# Altium project MACHDEN.PrjPcb
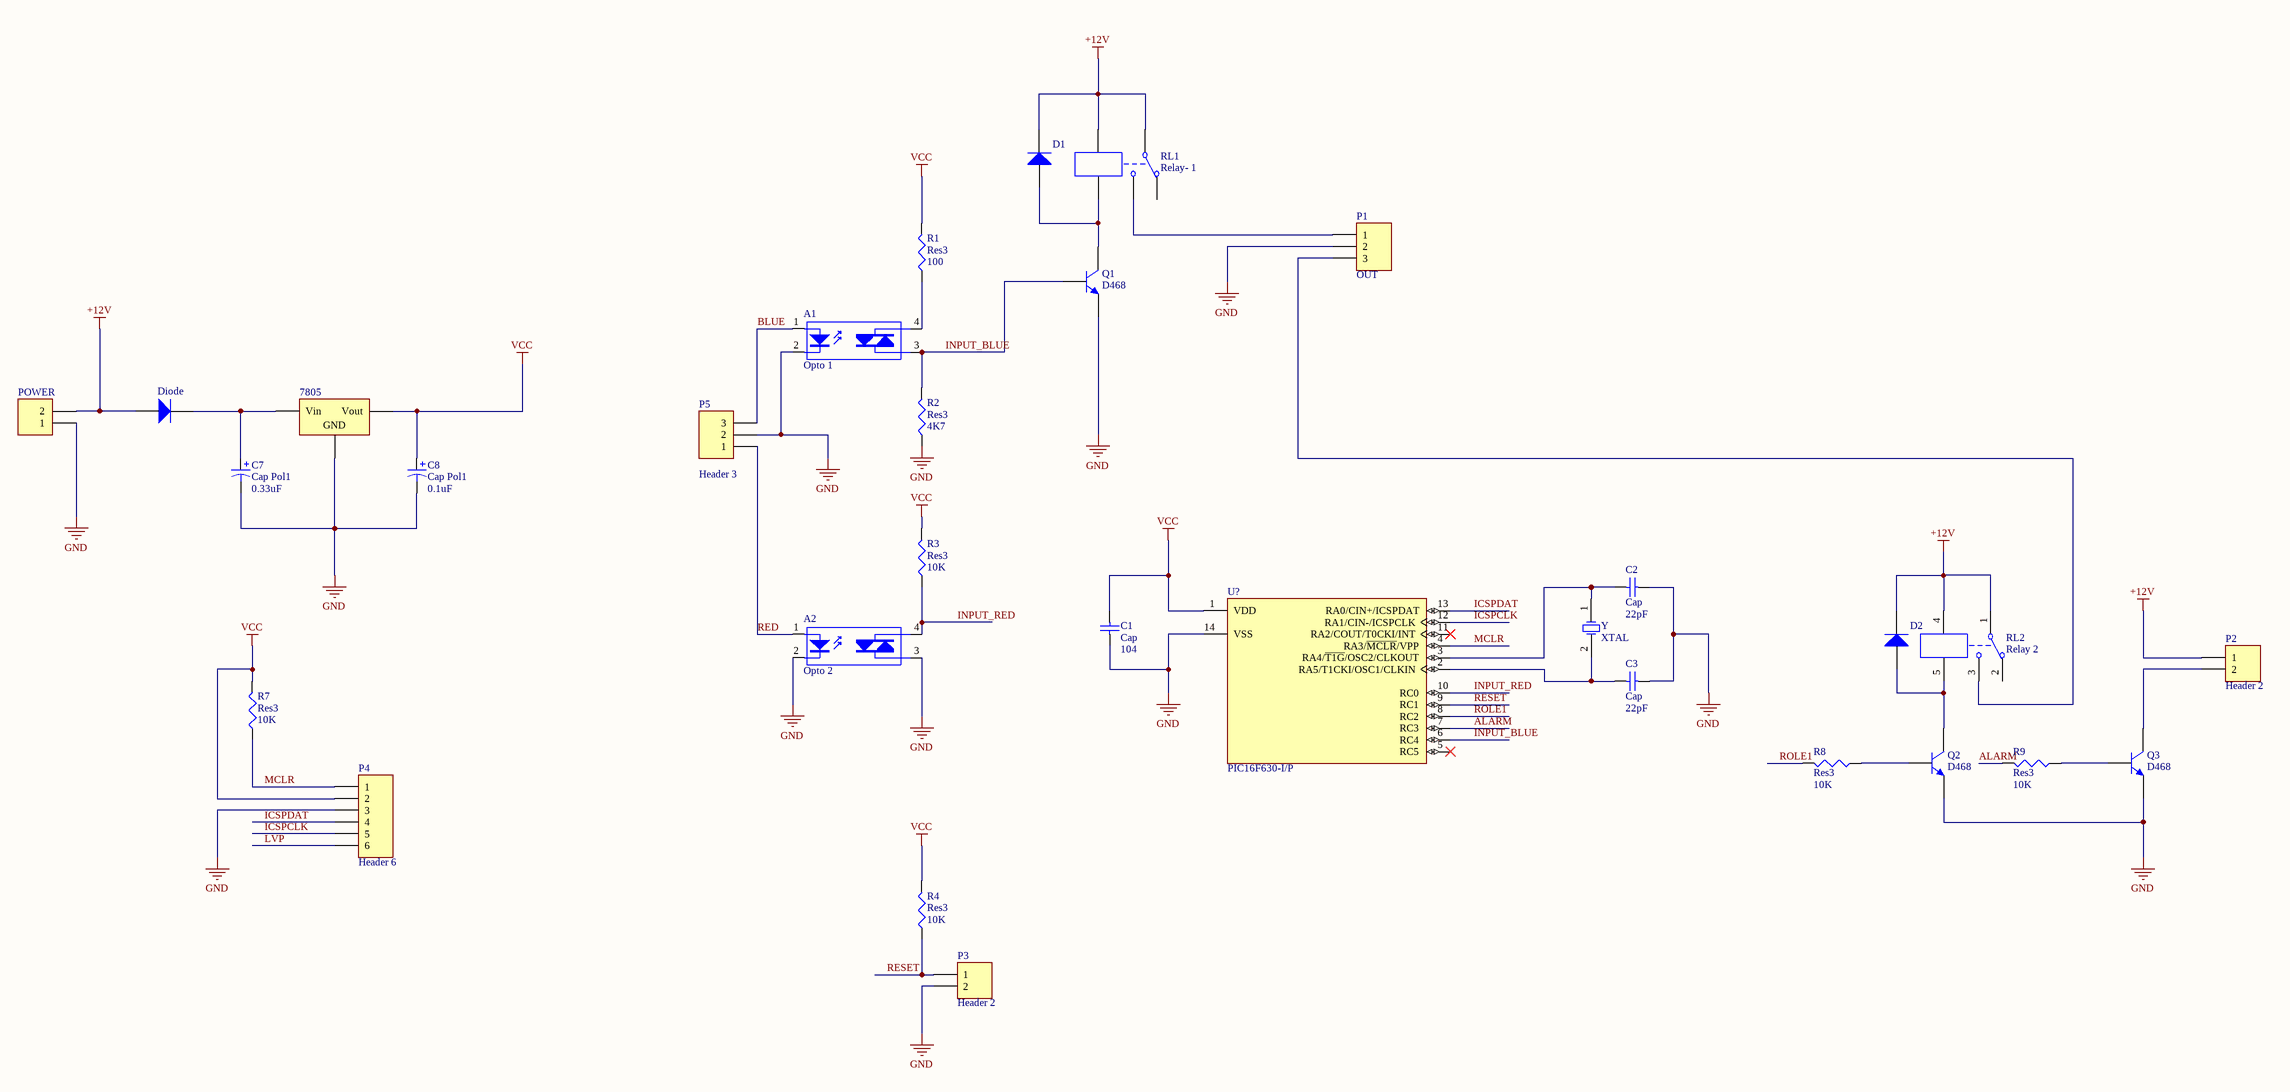
[diagram p0: MACHDEN.SchDoc]
1 sheet, 31 parts. Net scope: global (net labels, ports and power ports of the same name join across sheets).
Board file: MACHDEN.PcbDoc

## Sheet MACHDEN.SchDoc
size A2

### Parts
7805  Volt Reg  [78xx_NO]  (value not drawn)
A1  Opto 1  [Opto]
A2  Opto 2  [OPTO]
C1  Cap  value 104  [TU_gom]
C2  Cap  value 22pF  [tu_gom]
C3  Cap  value 22pF  [tu_gom]
C7  Cap Pol1  value 0.33uF  [TU 470uF/50V]
C8  Cap Pol1  value 0.1uF  [tu 100uF/50v]
D1  (no value)  [D_2A]
D2  (no value)  [D_2A]
Diode  Diode  [D_2A]  (value not drawn)
P1  OUT  [HEADER3]
P2  Header 2  [Header2 - duplicate]
P3  Header 2  [Header2 - duplicate]
P4  Header 6  [HDR1X6]
P5  Header 3  [HEADER3]
POWER  Header 2  [Header2 - duplicate]  (value not drawn)
Q1  D468  [C1815]
Q2  D468  [C1815]
Q3  D468  [C1815]
R1  Res3  value 100  [R_NOR]
R2  Res3  value 4K7  [R_nOR]
R3  Res3  value 10K  [R_Nor]
R4  Res3  value 10K  [R_Nor]
R7  Res3  value 10K  [R_Nor]
R8  Res3  value 10K  [R_Nor]
R9  Res3  value 10K  [R_Nor]
RL1  Relay- 1  [Role 12V]
RL2  Relay 2  [Role 12V]
U?  PIC16F630-I/P  [PDIP300-P14]
Y  XTAL  [Xtal12M]

### Nets
+12V: D1.2(K) D2.2(K) Diode.1(A) P2.1 POWER.2 RL1.1 RL1.4 RL2.1 RL2.4
GND: 7805.2(GND) A1.2(K) A2.2(K) A2.3(A/K) C1.1 C2.1 C3.1 C7.2 C8.2 P1.2 P3.2 P4.3 P5.2 POWER.1 Q1.1(E) Q2.1(E) Q3.1(E) R2.1 U?.14(VSS)
VCC: 7805.3(Vout) C1.2 C8.1 P4.2 R1.2 R3.2 R4.2 R7.2 U?.1(VDD)
ALARM: R9.2 U?.7(RC3)
BLUE: A1.1(A) P5.3
ICSPCLK: P4.5 U?.12(RA1/CIN-/ICSPCLK)
ICSPDAT: P4.4 U?.13(RA0/CIN+/ICSPDAT)
INPUT_BLUE: A1.3(A/K) Q1.3(B) R2.2 U?.6(RC4)
INPUT_RED: A2.4(A/K) R3.1 U?.10(RC0)
LVP: P4.6
MCLR: P4.1 R7.1 U?.4(RA3/~{MCLR}/VPP)
RED: A2.1(A) P5.1
RESET: P3.1 R4.1 U?.9(RC1)
ROLE1: R8.2 U?.8(RC2)
Net7805_1: 7805.1(Vin) C7.1 Diode.2(K)
NetA1_4: A1.4(A/K) R1.1
NetC2_2: C2.2 U?.3(RA4/~{T1G}/OSC2/CLKOUT) Y.1(OSC1)
NetC3_2: C3.2 U?.2(RA5/T1CKI/OSC1/CLKIN) Y.2(OSC2)
NetD1_1: D1.1(A) Q1.2(C) RL1.5
NetD2_1: D2.1(A) Q2.2(C) RL2.5
NetP1_1: P1.1 RL1.3
NetP1_3: P1.3 RL2.3
NetP2_2: P2.2 Q3.2(C)
NetQ2_3: Q2.3(B) R8.1
NetQ3_3: Q3.3(B) R9.1

Not connected (* = marked no-connect by the designer): RL1 2; RL2 2; U? 5(RC5)* 11(RA2/COUT/T0CKI/INT)*

### Library data of the parts
7805 = Volt Reg: Voltage Regulator; Published: 24-Mar-1999; LatestRevisionDate: 29-May-2009; LatestRevisionNote: IPC-7351 Footprint Added.; PackageReference: D2PAK; Publisher: Altium Limited; PackageDescription: 3-Pin Transistor Outline Package 2.54 mm Pitch, 15.1 mm Lead Span
A1 A2 = Opto TRIAC: Opto-Triac; Published: 24-Mar-1999; LatestRevisionDate: 17-Jul-2002; LatestRevisionNote: Re-released for DXP Platform.; PackageReference: NPSIP4A; Publisher: Altium Limited
C1-C3 = Cap: Capacitor; Published: 8-Jun-2000; LatestRevisionDate: 17-Jul-2002; LatestRevisionNote: Re-released for DXP Platform.; PackageReference: RAD-0.3; Publisher: Altium Limited
C7 C8 = Cap Pol1: Polarized Capacitor (Radial); Published: 8-Jun-2000; LatestRevisionDate: 17-Jul-2002; LatestRevisionNote: Re-released for DXP Platform.; PackageReference: RB7.6-15; Publisher: Altium Limited
D1 D2 Diode = Diode: Default Diode; Published: 8-Jun-2000; LatestRevisionDate: 17-Jul-2002; LatestRevisionNote: Re-released for DXP Platform.; PackageVersion: Sep-1996; PackageReference: SMC; Publisher: Altium Limited; Code_JEDEC: DO-214-AB
P1 P5 = Header 3: Header, 3-Pin; LatestRevisionDate: 17-Jul-2002; LatestRevisionNote: Re-released for DXP Platform.; Publisher: Altium Limited
P2 P3 POWER = Header 2: Header, 2-Pin; LatestRevisionDate: 17-Jul-2002; LatestRevisionNote: Re-released for DXP Platform.; Publisher: Altium Limited
P4 = Header 6: Header, 6-Pin; LatestRevisionDate: 17-Jul-2002; LatestRevisionNote: Re-released for DXP Platform.; Publisher: Altium Limited
Q1-Q3 = 2N3904: NPN General Purpose Amplifier; Published: 8-Jun-2000; LatestRevisionDate: 15-Jan-2003; LatestRevisionNote: PCB Footprint 'BCY-W3/D4.7' replaced; DatasheetVersion: 1997; PackageVersion: Sep-1998; PackageReference: TO-92A; Publisher: Altium Limited; Code_JEDEC: TO-92A; ComponentLink1Description: Manufacturer Link; ComponentLink1URL: http://www.fairchildsemi.com/; ComponentLink2Description: Datasheet; ComponentLink2URL: http://www.fairchildsemi.com/ds/2N%2F2N3904.pdf
R1-R4 R7-R9 = Res3: Resistor; Published: 8-Jun-2000; LatestRevisionDate: 29-May-2009; LatestRevisionNote: IPC-7351 Footprint Added.; PackageReference: J1-0603; Publisher: Altium Limited; PackageDescription: Chip Resistor
RL1 RL2 = Relay-SPDT: Single-Pole Dual-Throw Relay; Published: 24-Mar-1999; LatestRevisionDate: 17-Jul-2002; LatestRevisionNote: Re-released for DXP Platform.; PackageReference: MODULE5B; Publisher: Altium Limited
U? = PIC16F630-I/P: FLASH-Based 8-Bit CMOS Microcontroller, 1K (x14-Bit words) FLASH, 64 Bytes SRAM, 14-Pin PDIP, 2.0 to 5.5V Supply Range, Industrial Temperature; FirstPublished: 11-Oct-2004; LatestRevisionDate: 29-Jan-2009; LatestRevisionNote: Sch. layout revised. 3D Model Removed.; DatasheetVersion: revE, Mar-2007; PackageVersion: revBB, Aug-2009; PackageReference: PDIP300-P14; Publisher: Altium Limited; PackageDescription: 14-Lead Plastic Dual In-Line (P) - 300 mil Body [PDIP]; Supplier 1: Digi-Key; Supplier Part Number 1: PIC16F630-I/P-ND; Supplier 2: Farnell; Supplier Part Number 2: 9760458; Supplier 3: Farnell; Supplier Part Number 3: 1523939; Supplier 4: Newark; Supplier Part Number 4: 92C2421; ComponentLink1Description: Datasheet; ComponentLink1URL: http://ww1.microchip.com/downloads/en/DeviceDoc/40039E.pdf; ComponentLink2Description: Packaging Specification; ComponentLink2URL: http://www.microchip.com/stellent/groups/techpub_sg/documents/packagingspec/en012702.pdf; ComponentLink3Description: Microchip.com Home; ComponentLink3URL: http://www.microchip.com/
Y = XTAL: Crystal Oscillator; Published: 8-Jun-2000; LatestRevisionDate: 17-Jul-2002; LatestRevisionNote: Re-released for DXP Platform.; PackageReference: R38; Publisher: Altium Limited